# Altium schematic sheet Sheet2.SchDoc
size A4
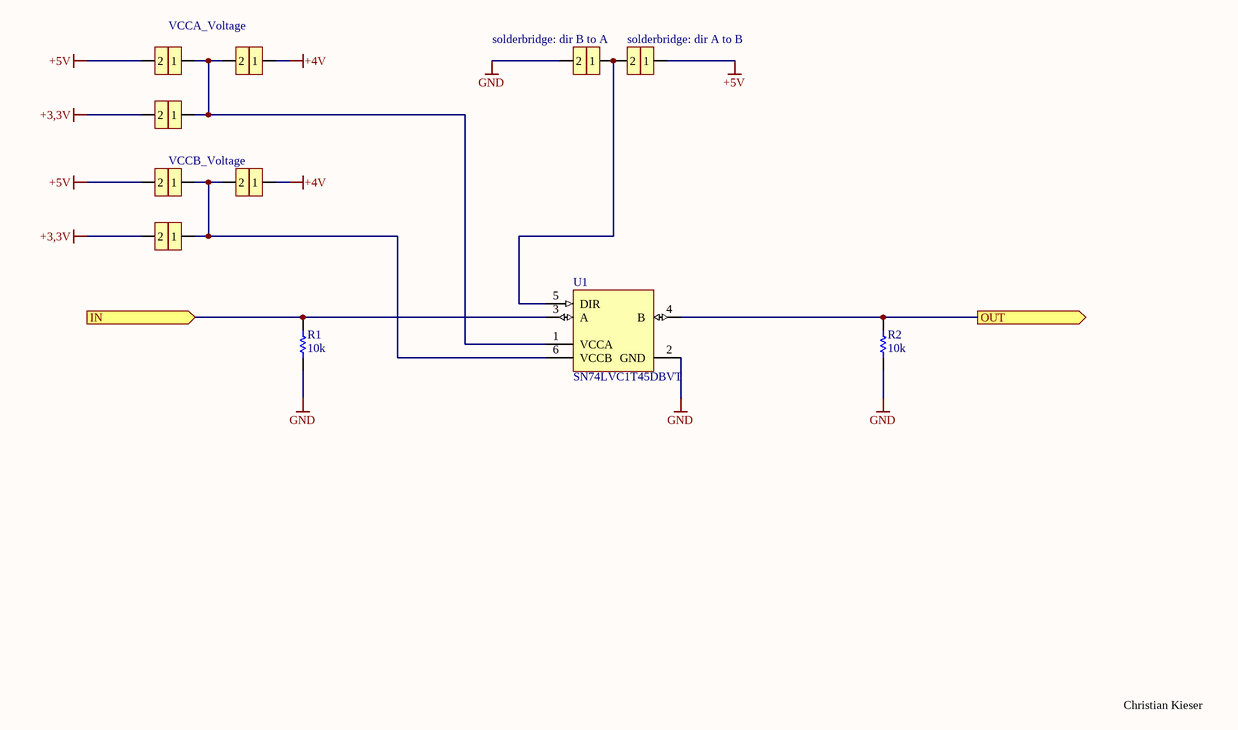
[diagram p0: Sheet2.SchDoc]

## Parts
J1  normal solderbridge  [PCBComponent]  (value not drawn)
J2  normal solderbridge  [PCBComponent]  (value not drawn)
J3  normal solderbridge  [PCBComponent]  (value not drawn)
J4  normal solderbridge  [PCBComponent]  (value not drawn)
J5  normal solderbridge  [PCBComponent]  (value not drawn)
J6  normal solderbridge  [PCBComponent]  (value not drawn)
J7  normal solderbridge  [PCBComponent]  (value not drawn)
J8  normal solderbridge  [PCBComponent]  (value not drawn)
R1  10k  [YAGO-RC0805_M]
R2  10k  [YAGO-RC0805_M]
U1  SN74LVC1T45DBVT  [DBV0006A_M]

## Ports
IN (in), OUT (out)

## Nets
+3,3V: J3.2 J6.2
+4V: J2.1 J5.1
+5V: J1.2 J4.2 J8.1
GND: J7.2 R1.1 R2.1 U1.2(GND)
IN: R1.2 U1.3(A) ; port IN
OUT: R2.2 U1.4(B) ; port OUT
NetJ1_1: J1.1 J2.2 J3.1 U1.1(VCCA)
NetJ4_1: J4.1 J5.2 J6.1 U1.6(VCCB)
NetJ7_1: J7.1 J8.2 U1.5(DIR)

## Notes on the sheet
- VCCA_Voltage
- solderbridge: dir B to A
- (near J8) solderbridge: dir A to B
- VCCB_Voltage
- Christian Kieser
- Title
- Size:
- Modified:
- A4
- Project:
- Time:
- Sheet
- of
- Created:
- Author:
- Prj. #:
- Alfons Riedinger
- File:
- Revision:

## Library data of the parts
J1-J8 = CMP-001-0133-A.1
R1 R2 = CMP-001-0027-2: 0805 Yageo Standard BlackBox Resistors; Power (Watts): 0.125W, 1/8W; Temperature Coefficient: ±200ppm/°C; Tolerance: ±1%; ComponentLink1Description: PYu-RC_Group_51_RoHS_L_7.pdf; Part Status: Active; Size / Dimension: 0.079" L x 0.049" W (2.00mm x 1.25mm); Supplier Device Package: 0805; ComponentLink1URL: http://www.yageo.com/documents/recent/PYu-RC_Group_51_RoHS_L_7.pdf; Composition: Thick Film; Failure Rate: -; Features: Moisture Resistant; Height - Seated (Max): 0.024" (0.60mm); Manufacturer: Yageo; Operating Temperature: -55°C ~ 155°C; Package / Case: 0805 (2012 Metric); Packaging: Digi-Reel®
U1 = CMP-00491-2: Single-Bit Dual-Supply Bus Transceiver with Configurable Voltage Translation and 3-State Outputs, DBV0006A, SMALL T&R; Manufacturer: Texas Instruments; PartNumber: SN74LVC1T45DBVTG4; 3-State Output: Yes; VCC(Min)(V): 1.65; tpd @ Nom Voltage(Max)(ns): 15.5,8,5.8,4.4; Technology Family: LVC; Logic: True; Bits(#): 1; Rating: Catalog; Sub-Family: Dual Supply Translator; Schmitt Trigger: No; VCC(Max)(V): 5.5; Voltage(Nom)(V): 1.8,2.5,3.3,5; Output Drive (IOL/IOH)(Max)(mA): 32/-32; Input Type: CMOS/TTL; ICC @ Nom Voltage(Max)(mA): 0.004; Output Type: CMOS; F @ Nom Voltage(Max)(Mhz): 150; DatasheetVersion: SCES515K; Operating Temperature Range(C): -40 to 85; Generic Part Number: SN74LVC1T45; PackageReference: DBV0006A